# EAGLE design BLE_torch_v1.0 (EAGLE 9.6.2)
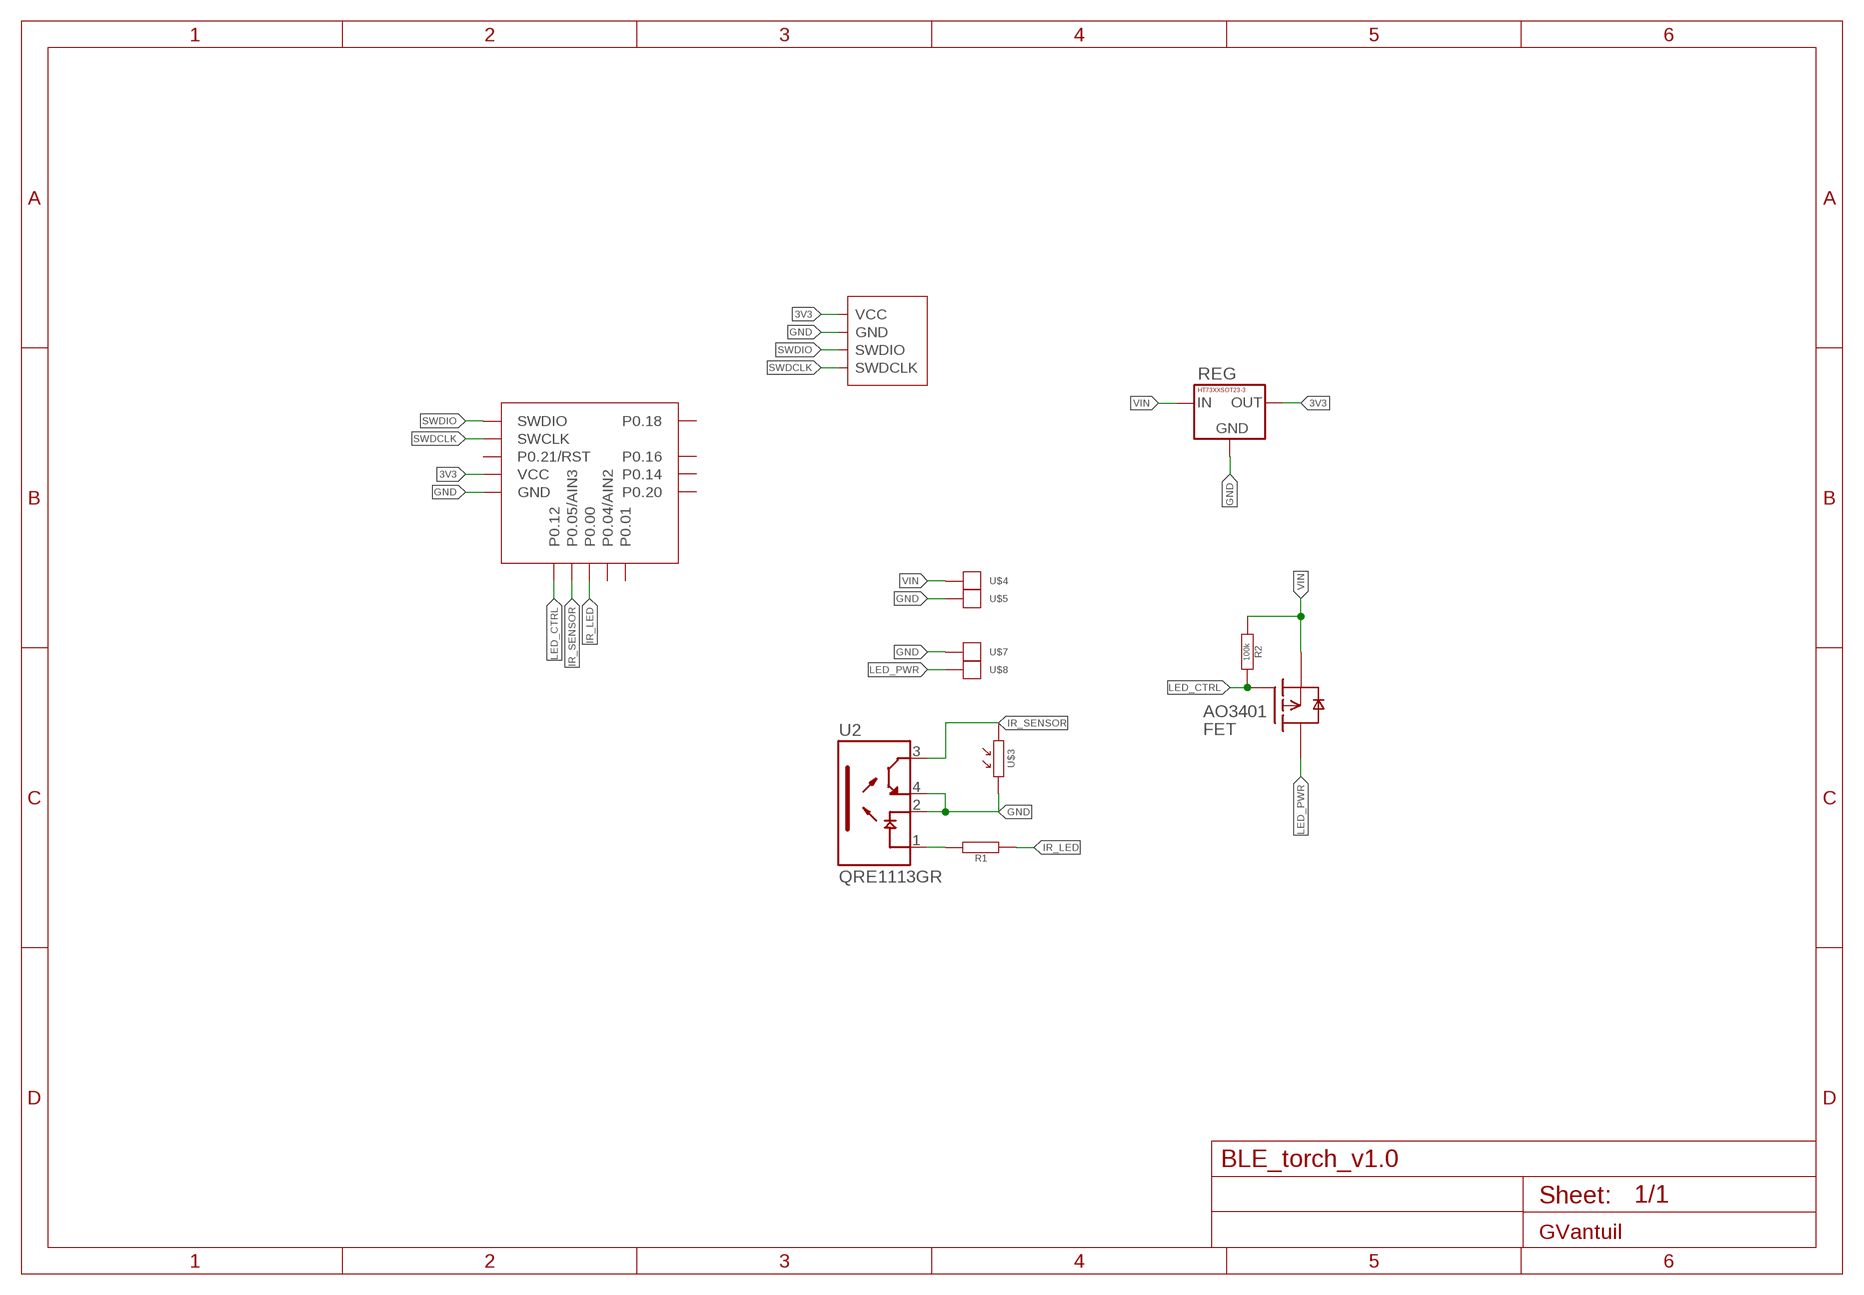
[diagram p0: schematic, sheet 1]

## Parts
FET  AO3401  [SOT23-3]
R1  RESISTOR0402-RES  [0402-RES]
R2  100k  RESISTOR0402-RES  [0402-RES]
REG  HT73XXSOT23-3  [SOT23-3]
U2  QRE1113GR  [SOIC180P460X187-4N]
U$2  E104-BT5005A  [E104-BT5005A]
U$3  LDR_5MM  [LDR_5MM]
U$4  PAD_50X100MIL  [PAD_50X100MIL]
U$5  PAD_50X100MIL  [PAD_50X100MIL]
U$6  GV_SWD_4P  [GV_SWD_1.27MM_4P_SEMI_SMD]
U$7  PAD_1.3X5MM  [PAD_1.3X5MM]
U$8  PAD_1.3X5MM  [PAD_1.3X5MM]

## Nets
3V3: REG.2(3.OUT) U$2.VCC U$6.VCC
GND [pwr]: REG.1(2.GND) U2.2(C) U2.4(ET) U$2.GND U$2.GND1(GND) U$3.P$1 U$5.P$1 U$6.GND U$7.P$1
IR_LED: R1.1 U$2.P0.00
IR_SENSOR: U2.3(CT) U$2.P0.05(P0.05/AIN3) U$3.P$2
LED_CTRL: FET.1(G) R2.2 U$2.P0.12
LED_PWR [pwr]: FET.3(D) U$8.P$1
N$10: R1.2 U2.1(A)
SWDCLK: U$2.SWCLK U$6.SWDCLK
SWDIO: U$2.SWDIO U$6.SWDIO
VIN [pwr]: FET.2(S) R2.1 REG.3(1.IN) U$4.P$1
Unconnected: U$2.P0.01 U$2.P0.04(P0.04/AIN2) U$2.P0.14 U$2.P0.16 U$2.P0.18 U$2.P0.20 U$2.P0.21/RST

## Library data of the parts
FET = 0000_GV_transistors:AO3401: 30V N-Channel MOSFET The AO3404 uses advanced trench technology to provide excellent RDS(ON) and low gate charge. This device may be used as a load switch or in PWM applications. Maximum ratings: Drain-Source Voltage: 30V Gate-Source Voltage: +-20V Continuous Drain Current: 5 (25 C) / 4 (70 C) A Gate Threshold Voltage: 1.2 - 2.4 V Check prices <https://pricing.snapeda.com/parts/AO3401/Alpha%20%26%20Omega%20Semiconductor/view-part?ref=eda>; AVAILABILITY: Bad; DESCRIPTION: P-Channel 30V 4A (Ta) 1.4W (Ta) Surface Mount SOT-23-3L; MF: Alpha & Omega Semiconductor; MP: AO3401; PACKAGE: SOT-23-3 Alpha &amp; Omega Semiconductor; PRICE: None
R1 R2 = 0000_GV_resistors:RESISTOR: Resistor Basic schematic elements and footprints for 0603, 1206, and PTH 1/10th watt (small) resistors.
REG = 0000_GV_regulators:HT73XX
U2 = 0000_GV_sensors:QRE1113GR: QRE1113 Series 30 V 50 mA Miniature Reflective Object Sensor - SMD-4 Check availability <https://pricing.snapeda.com/parts/QRE1113GR/ON%20Semiconductor/view-part?ref=eda>; AVAILABILITY: In Stock; CHECK_PRICES: https://www.snapeda.com/parts/QRE1113GR/Onsemi/view-part/?ref=eda; DESCRIPTION: Reflective Optical Sensor 0.039 (1mm) 4-SMD, Gull Wing; MF: ON Semiconductor; MP: QRE1113GR; PACKAGE: ARUSM-313-4 ON Semiconductor; PRICE: None; SNAPEDA_LINK: https://www.snapeda.com/parts/QRE1113GR/Onsemi/view-part/?ref=snap
U$2 = 0000_GV_MCUs:E104-BT5005A
U$3 = 0000_GV_sensors:LDR
U$4 U$5 U$7 U$8 = 0000_GV_connectors:PAD
U$6 = 0000_GV_connectors:GV_SWD_4P

## Net classes
1 pwr: width 0.305 mm

## Board
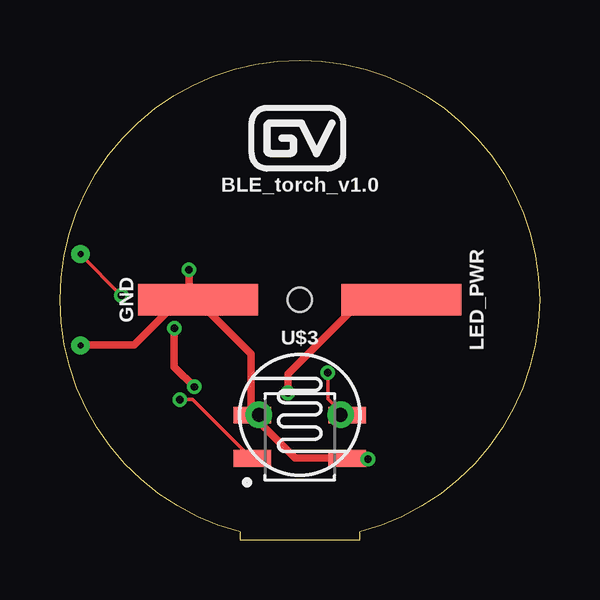
[diagram p1: board, top side]
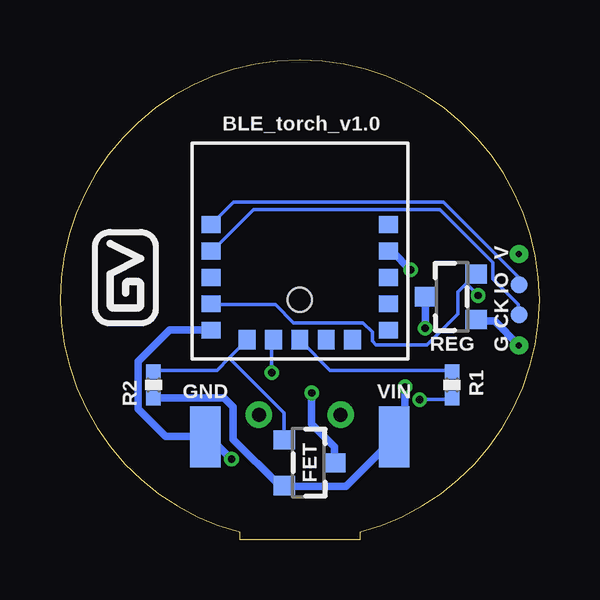
[diagram p2: board, bottom side, seen from below]

Size 20 x 20 mm. Coordinates in mm from the lower left corner, seen from the top.
Outline: 7.5,0.32 7.5,0 12.5,0 12.5,0.32 arc76 20,10 arc90 10,20 arc90 0,10 arc76 7.5,0.32
Copper layers (1*16): Top 0.035mm / dielectric 1.5mm / Bottom 0.035mm
Design rules "jlcpcb-2layers": minimum track width 6mil, minimum drill 12mil, track to track 6mil, track to pad 6mil, pad to pad 6mil, via to via 6mil, smd to smd 0mil, copper to edge 10mil, drill to drill 10mil, minimum pad ring 10mil, minimum via ring 6mil, stop-mask expansion 2mil, vias tented up to drill 100mil, thermal gap 10mil
Holes 1 mm at 10,10
tKeepout: area 1,1 to 19,19

### Footprints (pad centres in the part's own frame; a part is rotated, then mirrored left to right if it is on the bottom)
SOT23-3 = smd 0.8 x 0.9: 1 -0.95,-1; 2 0.95,-1; 3 0,1.1
0402-RES = smd 0.6 x 0.6: 1 -0.55,0; 2 0.55,0
SOIC180P460X187-4N = smd 0.69 x 1.57: 1 -0.9,1.975; 2 -0.9,-1.975; 3 0.9,-1.975; 4 0.9,1.975
E104-BT5005A = smd 0.8 x 0.7: GND -3.7,-3.3; GND1 3.7,0; P0.14 3.7,-2.2; P0.16 3.7,-1.1; P0.18 3.7,1.1; P0.20 3.7,-3.3; P0.21/RST -3.7,-1.1; SWCLK -3.7,0; SWDIO -3.7,1.1; VCC -3.7,-2.2 | smd 0.7 x 0.8: P0.00 0,-3.7; P0.01 2.2,-3.7; P0.04 1.1,-3.7; P0.05 -1.1,-3.7; P0.12 -2.2,-3.7
LDR_5MM = drill 0.6: P$1 -1.7,0; P$2 1.7,0
PAD_50X100MIL = smd 1.27 x 2.54: P$1 0,0
GV_SWD_1.27MM_4P_SEMI_SMD = drill 0.25 pad 0.7: GND -1.905,0; VCC 1.905,0 | smd 0.7 x 0.7: SWDCLK -0.635,0; SWDIO 0.635,0
PAD_1.3X5MM = smd 5 x 1.3: P$1 0,0

### Placement (x,y rotation side)
FET  9.65,3.2 270 bottom
R1  3.65,6.44 270 bottom
R2  16.1,6.44 90 bottom
REG  3.65,10.13 90 bottom
U2  10,4.29 90 top
U$2  10,12.03 0 bottom
U$3  10,5.2 0 top
U$4  6.06,4.29 0 bottom
U$5  13.94,4.29 180 bottom
U$6  0.86,10 90 bottom
U$7  5.76,10 180 top
U$8  14.24,10 180 top
U$9  [GV_5MM]  7.84,15.31 0 top
U$10  [GV_5MM]  15.84,8.86 90 bottom

### Tracks (layer width: path | path; a pad name or v marks a point on that pad's centre or on a via)
3V3  (via drill 0.3)
  Top 0.152: v2.56,10.18 0.88,11.85 U$6.VCC
  Bottom 0.152: 3.05,10.67 2.71,11.02 REG.2 | 3.05,10.67 3.4,10.33 3.4,9.42 4.69,8.12 6.83,8.12 6.98,8.27 6.98,8.65 7.36,9.04 10.25,9.04 11.02,9.8 13.68,9.8 U$2.VCC | 3.05,10.67 v2.56,10.18
GND  (via drill 0.3)
  Top 0.305: U2.4 8.04,5.15 9.8,3.4 11.93,3.4 U2.2 12.82,3.38 v12.85,3.36 | v5.38,11.24 5.38,10.41 5.76,10.03 U$7.P$1 | U$6.GND 0.88,8.12 3.09,8.12 5.3,10.33 U$7.P$1 | U2.4 7.97,5.3 7.97,7.74 5.83,9.87 U$7.P$1 | U2.4 8.29,5.18 U$3.P$1
  Bottom 0.305: U$2.GND 13.76,8.73 15.44,8.73 16.73,7.43 16.73,5.45 15.59,4.31 13.99,4.31 U$5.P$1 13.79,4.29 12.86,3.36 v12.85,3.36 | U$6.GND 1.87,9.11 2.63,9.11 REG.1 | v5.38,11.24 6.14,12.01 6.29,12.01 U$2.GND1
IR_LED
  Bottom 0.152: R1.1 3.7,7.05 8.73,7.05 9.95,8.27 U$2.P0.00
IR_SENSOR  (via drill 0.3)
  Top 0.152: v11.17,6.96 11.17,5.86 11.85,5.18 U2.3 U$3.P$2
  Bottom 0.152: v11.17,6.96 11.17,8.27 U$2.P0.05
LED_CTRL
  Bottom 0.152: 12.94,7.57 12.23,8.27 U$2.P0.12 | 12.94,7.57 13.45,7.05 16.05,7.05 R2.2 | 12.94,7.57 10.65,5.28 FET.1
LED_PWR  (via drill 0.3)
  Top 0.305: U$8.P$1 12.59,10 9.51,6.92 v9.51,6.12
  Bottom 0.305: FET.3 8.55,3.85 9.51,4.82 v9.51,6.12
N$10  (via drill 0.3)
  Top 0.152: v5,5.83 5.53,5.83 7.97,3.4 U2.1
  Bottom 0.152: v5,5.83 3.7,5.83 R1.2
SWDCLK
  Bottom 0.152: U$6.SWDCLK 0.88,9.42 0.88,9.8 1.95,10.86 1.95,11.55 4.16,13.76 11.93,13.76 13.68,12.01 U$2.SWCLK
SWDIO
  Bottom 0.152: U$6.SWDIO 0.88,10.63 0.88,10.94 4.01,14.06 12.77,14.06 13.68,13.15 U$2.SWDIO
VIN  (via drill 0.3)
  Top 0.305: v4.77,8.81 4.77,7.21 v5.61,6.37
  Bottom 0.305: R2.1 16.05,5.91 13.16,5.91 12.79,5.54 12.79,4.19 10.84,2.25 FET.2 10.61,2.21 8.08,2.21 6.14,4.16 U$4.P$1 6.06,4.31 5.61,4.77 v5.61,6.37 | v4.77,8.81 4.77,10.1 REG.3

### Text on the board
tNames: BLE_torch_v1.0 | GND | LED_PWR
bNames: BLE_torch_v1.0 | VIN | GND